# Altium schematic sheet ADC.SchDoc: 12 Bit ADC's
size Letter; Date: Jul 31/2018; Revision: 1; SheetNumber: 3; SheetTotal: 9
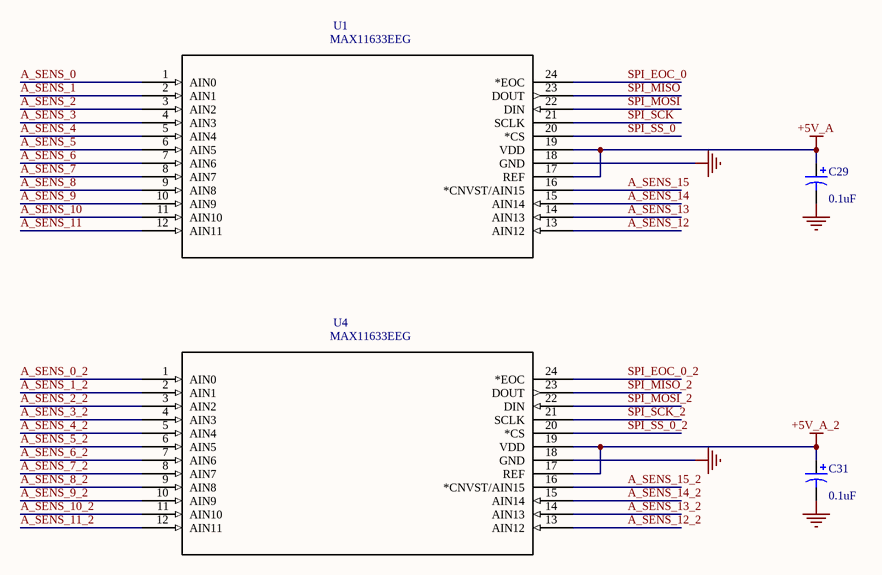
[diagram p0: ADC.SchDoc]

## Parts
C29  value 0.1uF  [1206-Polarized]  (hidden comment: Cap Pol3)
C31  value 0.1uF  [1206-Polarized]  (hidden comment: Cap Pol3)
U1  MAX11633EEG  [21-0055H_24]
U4  MAX11633EEG  [21-0055H_24]

## Nets
+5V_A: C29.1 U1.17(REF) U1.19(VDD)
+5V_A_2: C31.1 U4.17(REF) U4.19(VDD)
GND: C29.2 C31.2 U1.18(GND) U4.18(GND)
A_SENS_0: U1.1(AIN0)
A_SENS_0_2: U4.1(AIN0)
A_SENS_1: U1.2(AIN1)
A_SENS_1_2: U4.2(AIN1)
A_SENS_2: U1.3(AIN2)
A_SENS_2_2: U4.3(AIN2)
A_SENS_3: U1.4(AIN3)
A_SENS_3_2: U4.4(AIN3)
A_SENS_4: U1.5(AIN4)
A_SENS_4_2: U4.5(AIN4)
A_SENS_5: U1.6(AIN5)
A_SENS_5_2: U4.6(AIN5)
A_SENS_6: U1.7(AIN6)
A_SENS_6_2: U4.7(AIN6)
A_SENS_7: U1.8(AIN7)
A_SENS_7_2: U4.8(AIN7)
A_SENS_8: U1.9(AIN8)
A_SENS_8_2: U4.9(AIN8)
A_SENS_9: U1.10(AIN9)
A_SENS_9_2: U4.10(AIN9)
A_SENS_10: U1.11(AIN10)
A_SENS_10_2: U4.11(AIN10)
A_SENS_11: U1.12(AIN11)
A_SENS_11_2: U4.12(AIN11)
A_SENS_12: U1.13(AIN12)
A_SENS_12_2: U4.13(AIN12)
A_SENS_13: U1.14(AIN13)
A_SENS_13_2: U4.14(AIN13)
A_SENS_14: U1.15(AIN14)
A_SENS_14_2: U4.15(AIN14)
A_SENS_15: U1.16(*CNVST/AIN15)
A_SENS_15_2: U4.16(*CNVST/AIN15)
SPI_EOC_0: U1.24(*EOC)
SPI_EOC_0_2: U4.24(*EOC)
SPI_MISO: U1.23(DOUT)
SPI_MISO_2: U4.23(DOUT)
SPI_MOSI: U1.22(DIN)
SPI_MOSI_2: U4.22(DIN)
SPI_SCK: U1.21(SCLK)
SPI_SCK_2: U4.21(SCLK)
SPI_SS_0: U1.20(*CS)
SPI_SS_0_2: U4.20(*CS)

## Notes on the sheet
- Date:
- Revision:
- Sheet:
- /

## Library data of the parts
C29 C31 = Cap Pol3: Polarized Capacitor (Surface Mount); Published: 8-Jun-2000; LatestRevisionDate: 29-May-2009; LatestRevisionNote: IPC-7351 Footprint Added.; PackageReference: C0805; Publisher: Altium Limited; PackageDescription: Chip Capacitor
U1 U4 = MAX11633EEG: ADC Single SAR 300ksps 12-bit Serial 24-Pin QSOP; MP: MAX11633EEG+; MF: Maxim Integrated; SnapEDA_Link: https://www.snapeda.com/parts/MAX11633EEG%2B/Maxim%20Integrated/view-part/?ref=snap; Package: QSOP-24 Maxim Integrated; Digi-Key_Purchase_URL: https://www.digikey.ca/product-detail/en/maxim-integrated/MAX11633EEG-/MAX11633EEG--ND/2591497?utm_source=snapeda&utm_medium=aggregator&utm_campaign=symbol; Digi-Key_Part_Number: MAX11633EEG+-ND; Value: *